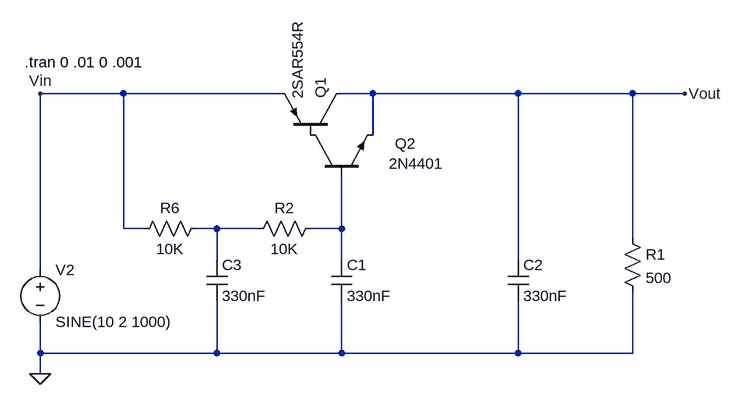
[diagram p0: schematic cap_mult.asc]
cap_mult.asc, the LTspice schematic file:
Version 4
SHEET 1 1784 1940
WIRE 272 624 144 624
WIRE 512 624 272 624
WIRE 656 624 608 624
WIRE 880 624 656 624
WIRE 1056 624 880 624
WIRE 1136 624 1056 624
WIRE 656 688 656 624
WIRE 272 832 272 624
WIRE 304 832 272 832
WIRE 416 832 384 832
WIRE 480 832 416 832
WIRE 608 832 608 752
WIRE 608 832 560 832
WIRE 1056 848 1056 624
WIRE 416 880 416 832
WIRE 608 880 608 832
WIRE 880 880 880 624
WIRE 144 896 144 624
WIRE 144 1024 144 976
WIRE 416 1024 416 944
WIRE 416 1024 144 1024
WIRE 608 1024 608 944
WIRE 608 1024 416 1024
WIRE 880 1024 880 944
WIRE 880 1024 608 1024
WIRE 1056 1024 1056 928
WIRE 1056 1024 880 1024
WIRE 144 1056 144 1024
FLAG 144 624 Vin
FLAG 1136 624 Vout
FLAG 144 1056 0
SYMBOL voltage 144 880 R0
WINDOW 123 0 0 Left 0
WINDOW 39 0 0 Left 0
SYMATTR InstName V2
SYMATTR Value SINE(10 2 1000)
SYMBOL npn 560 752 R270
WINDOW 0 51 130 VRight 2
WINDOW 3 20 121 VRight 2
SYMATTR InstName Q2
SYMATTR Value 2N4401
SYMBOL cap 592 880 R0
SYMATTR InstName C1
SYMATTR Value 330nF
SYMBOL res 400 816 R90
WINDOW 0 0 56 VBottom 2
WINDOW 3 32 56 VTop 2
SYMATTR InstName R6
SYMATTR Value 10K
SYMBOL cap 864 880 R0
SYMATTR InstName C2
SYMATTR Value 330nF
SYMBOL res 1040 832 R0
SYMATTR InstName R1
SYMATTR Value 500
SYMBOL pnp 608 688 M270
SYMATTR InstName Q1
SYMATTR Value 2SAR554R
SYMBOL cap 400 880 R0
SYMATTR InstName C3
SYMATTR Value 330nF
SYMBOL res 576 816 R90
WINDOW 0 0 56 VBottom 2
WINDOW 3 32 56 VTop 2
SYMATTR InstName R2
SYMATTR Value 10K
TEXT 120 576 Left 2 !.tran 0 .01 0 .001

The netlist it stands for:
* cap_mult.asc
V2 Vin 0 SINE(10 2 1000)
Q2 P001 N002 Vout 0 2N4401
C1 N002 0 330nF
R6 N001 Vin 10K
C2 Vout 0 330nF
R1 Vout 0 500
Q1 Vout P001 Vin 0 2SAR554R
C3 N001 0 330nF
R2 N002 N001 10K
.model NPN NPN
.model PNP PNP
.lib standard.bjt
.tran 0 .01 0 .001
.backanno
.end